# Altium schematic sheet Uc_Ticketing_Master.SchDoc
size A4; Author: Mario Dos Santos; Organization: ETML-ES; Address1: Avenue Recordon 1; Address2: 1004 Lausanne; Address3: Switzerland; Revision: C; SheetNumber: 3; SheetTotal: 6
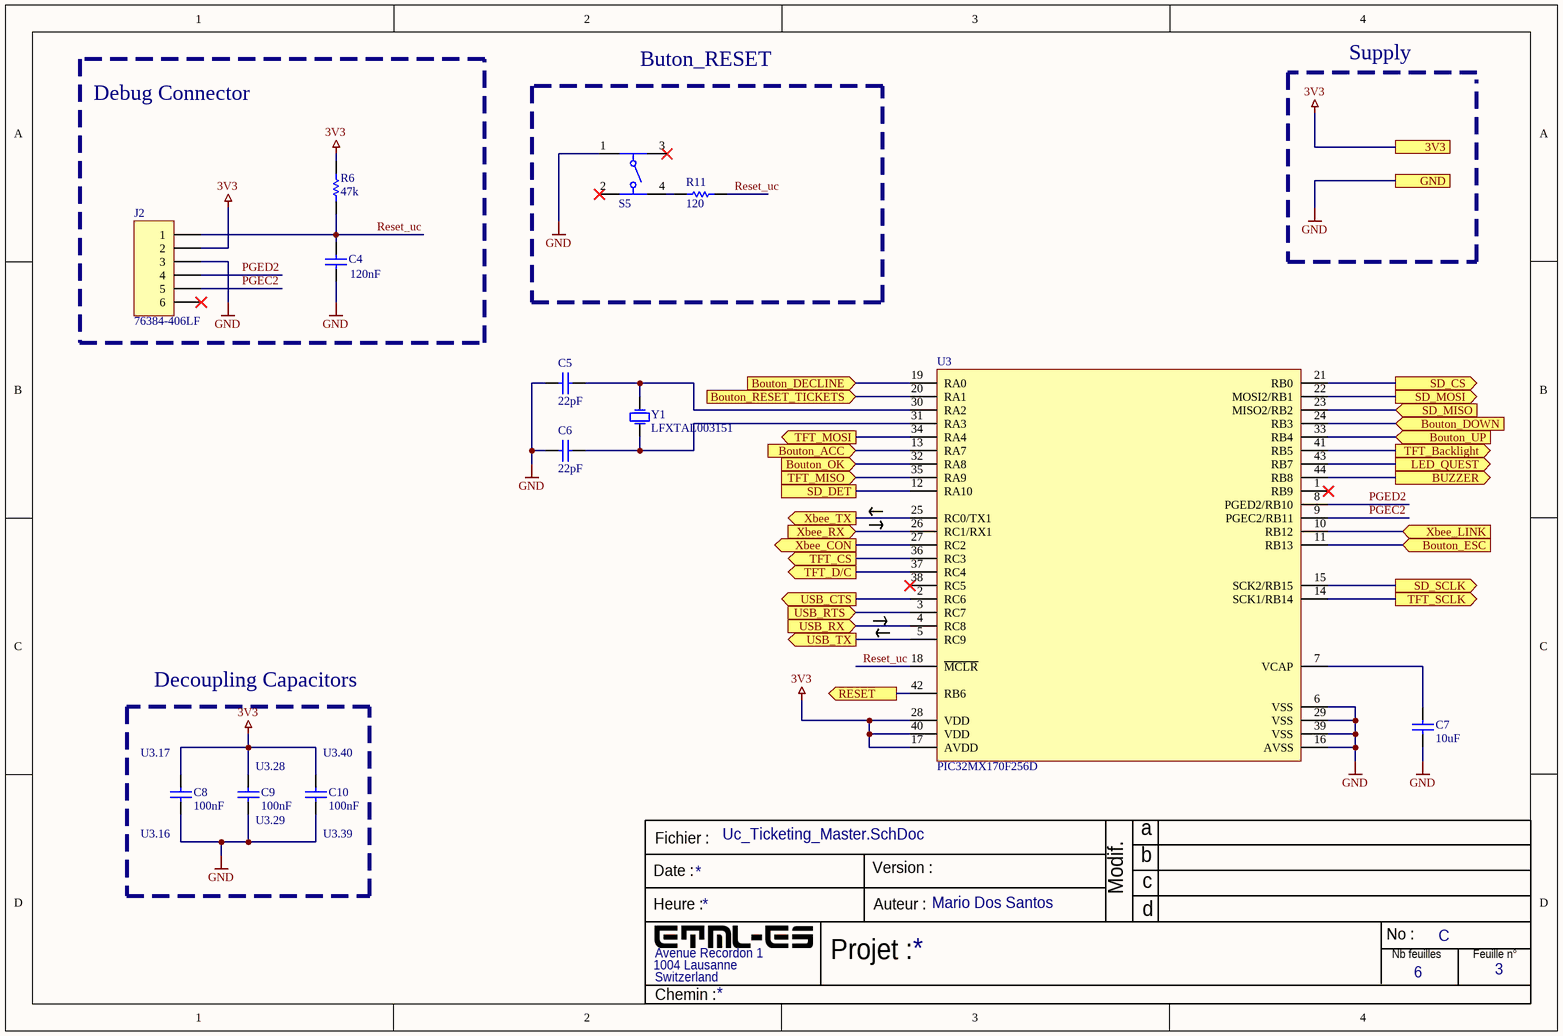
[diagram p0: Uc_Ticketing_Master.SchDoc]

## Parts
C4  120nF  [6-0805_N]
C5  22pF  [6-0805_N]
C6  22pF  [6-0805_N]
C7  10uF  [6-0805_N]
C8  100nF  [6-0805_N]
C9  100nF  [6-0805_N]
C10  100nF  [6-0805_N]
J2  76384-406LF  [76384-406LF]
R6  47k  [RESC0805(2012)_L]
R11  120  [RESC0805(2012)_L]
S5  430182050816  [430182050816]  (value not drawn)
U3  PIC32MX170F256D  [MCHP-TQFP-PT44_N]
Y1  LFXTAL003151  [LFXTAL003151REEL]

## Blocks framed on the sheet
Debug Connector: C4 J2 R6
Buton_RESET: R11 S5
Decoupling Capacitors: C8-C10

## Ports
3V3, Bouton_ACC (in), Bouton_DECLINE (in), Bouton_DOWN (in), Bouton_ESC (in), Bouton_OK (in), Bouton_RESET_TICKETS (in), Bouton_UP (in), BUZZER (out), GND, LED_QUEST (out), RESET (out), SD_CS (out), SD_DET, SD_MISO (in), SD_MOSI (out), SD_SCLK (out), TFT_Backlight (out), TFT_CS (out), TFT_D/C (out), TFT_MISO (in), TFT_MOSI (out), TFT_SCLK (out), USB_CTS (out), USB_RTS (in), USB_RX (in), USB_TX (out), Xbee_CON (out), Xbee_LINK (in), Xbee_RX (in), Xbee_TX (out)

## Nets
3V3: C8.2 C9.2 C10.2 J2.2 R6.1 U3.17(AVDD) U3.28(VDD) U3.40(VDD) ; port 3V3
GND: C4.1 C5.1 C6.1 C7.1 C8.1 C9.1 C10.1 J2.3 S5.1 U3.6(VSS) U3.16(AVSS) U3.29(VSS) U3.39(VSS) ; port GND
Bouton_ACC: U3.13(RA7) ; port Bouton_ACC
Bouton_DECLINE: U3.19(RA0) ; port Bouton_DECLINE
Bouton_DOWN: U3.24(RB3) ; port Bouton_DOWN
Bouton_ESC: U3.11(RB13) ; port Bouton_ESC
Bouton_OK: U3.32(RA8) ; port Bouton_OK
Bouton_RESET_TICKETS: U3.20(RA1) ; port Bouton_RESET_TICKETS
Bouton_UP: U3.33(RB4) ; port Bouton_UP
BUZZER: U3.44(RB8) ; port BUZZER
LED_QUEST: U3.43(RB7) ; port LED_QUEST
PGEC2: J2.5 U3.9(PGEC2/RB11)
PGED2: J2.4 U3.8(PGED2/RB10)
RESET: U3.42(RB6) ; port RESET
Reset_uc: C4.2 J2.1 R6.2 R11.2 U3.18(~{MCLR})
SD_CS: U3.21(RB0) ; port SD_CS
SD_DET: U3.12(RA10) ; port SD_DET
SD_MISO: U3.23(MISO2/RB2) ; port SD_MISO
SD_MOSI: U3.22(MOSI2/RB1) ; port SD_MOSI
SD_SCLK: U3.15(SCK2/RB15) ; port SD_SCLK
TFT_Backlight: U3.41(RB5) ; port TFT_Backlight
TFT_CS: U3.36(RC3) ; port TFT_CS
TFT_D/C: U3.37(RC4) ; port TFT_D/C
TFT_MISO: U3.35(RA9) ; port TFT_MISO
TFT_MOSI: U3.34(RA4) ; port TFT_MOSI
TFT_SCLK: U3.14(SCK1/RB14) ; port TFT_SCLK
USB_CTS: U3.2(RC6) ; port USB_CTS
USB_RTS: U3.3(RC7) ; port USB_RTS
USB_RX: U3.4(RC8) ; port USB_RX
USB_TX: U3.5(RC9) ; port USB_TX
Xbee_CON: U3.27(RC2) ; port Xbee_CON
Xbee_LINK: U3.10(RB12) ; port Xbee_LINK
Xbee_RX: U3.26(RC1/RX1) ; port Xbee_RX
Xbee_TX: U3.25(RC0/TX1) ; port Xbee_TX
NetC5_2: C5.2 U3.30(RA2) Y1.1
NetC6_2: C6.2 U3.31(RA3) Y1.2
NetC7_2: C7.2 U3.7(VCAP)
NetR11_1: R11.1 S5.4

Not connected (* = marked no-connect by the designer): J2 6*; S5 2* 3*; U3 1(RB9)* 38(RC5)*

## Notes on the sheet
- Supply
- (near C8) U3.17
- (near C9) U3.28
- (near C10) U3.40
- (near C8) U3.16
- (near C9) U3.29
- (near C10) U3.39
- Fichier :
- a
- Date :
- Heure :
- Version :
- Auteur :
- Modif.
- b
- c
- d
- Projet :
- No :
- Nb feuilles
- Feuille n°
- Chemin :

## Library data of the parts
C4 C7-C10 = Cap: Capacitor; Supplier: Digi-Key
  C4: Value: 120nF; Supplier Part Number: 311-4323-1-ND; Supplier unit price: 0.18
  C7: Value: 10uF; Supplier Part Number: 1276-1298-1-ND; Supplier unit price: 0.1
  C8-C10: Value: 100nF; Supplier Part Number: 399-C0805C104M5RAC7800CT-ND; Supplier unit price: 0.1
C5 C6 = CMP-2007-03167-1: VJ0805Y104KNAAT; Supplier: Digi-Key; Supplier Part Number: 399-C0805C220J5GAC7800CT-ND; Supplier unit price: 0.1; Value: 22pF
J2 = Header 6: Header, 6-Pin; LatestRevisionDate: 17-Jul-2002; LatestRevisionNote: Re-released for DXP Platform.; Publisher: Altium Limited; Supplier 1: Digi-Key; Supplier Part Number 1: 609-1321-ND; Supplier unit price: 0.66; Value: 76384-406LF; Supplier: Digi-Key; Supplier Part Number: 609-1321-ND
R6 = CMP-1013-00122-1: 100K 0.125W 5% 0805 (2012 Metric)  SMD; Value: 47k; Supplier: Digi-Key; Supplier Part Number: A130144CT-ND; Supplier unit price: 0.1
R11 = CMP-1013-00122-1: 100K 0.125W 5% 0805 (2012 Metric)  SMD; Value: 10k; Supplier: Digi-Key; Supplier Part Number: A129738CT-ND; Supplier unit price: 0.1
S5 = 430182050816: 6x6mm SMD Tact Switch WS-TASV, height 5 mm, 160 gf; Supplier: Digi-Key; Supplier Part Number: 732-7005-1-ND; Supplier unit price: 0.51; Value: 430182050816
U3 = MCHP-PIC32MX2XXFXXXD-TQFP-44: Supplier: Digi-Key; Supplier Part Number: PIC32MX170F256D-I/PT-ND; Supplier unit price: 5.43
Y1 = LFXTAL003151REEL: Crystal or Oscillator; Frequency: 8MHz; Supplier: Farnell; Supplier Part Number: 9713794; Supplier unit price: 0.392; Value: LFXTAL003151